# EAGLE design TinyConsole (EAGLE 9.6.2)
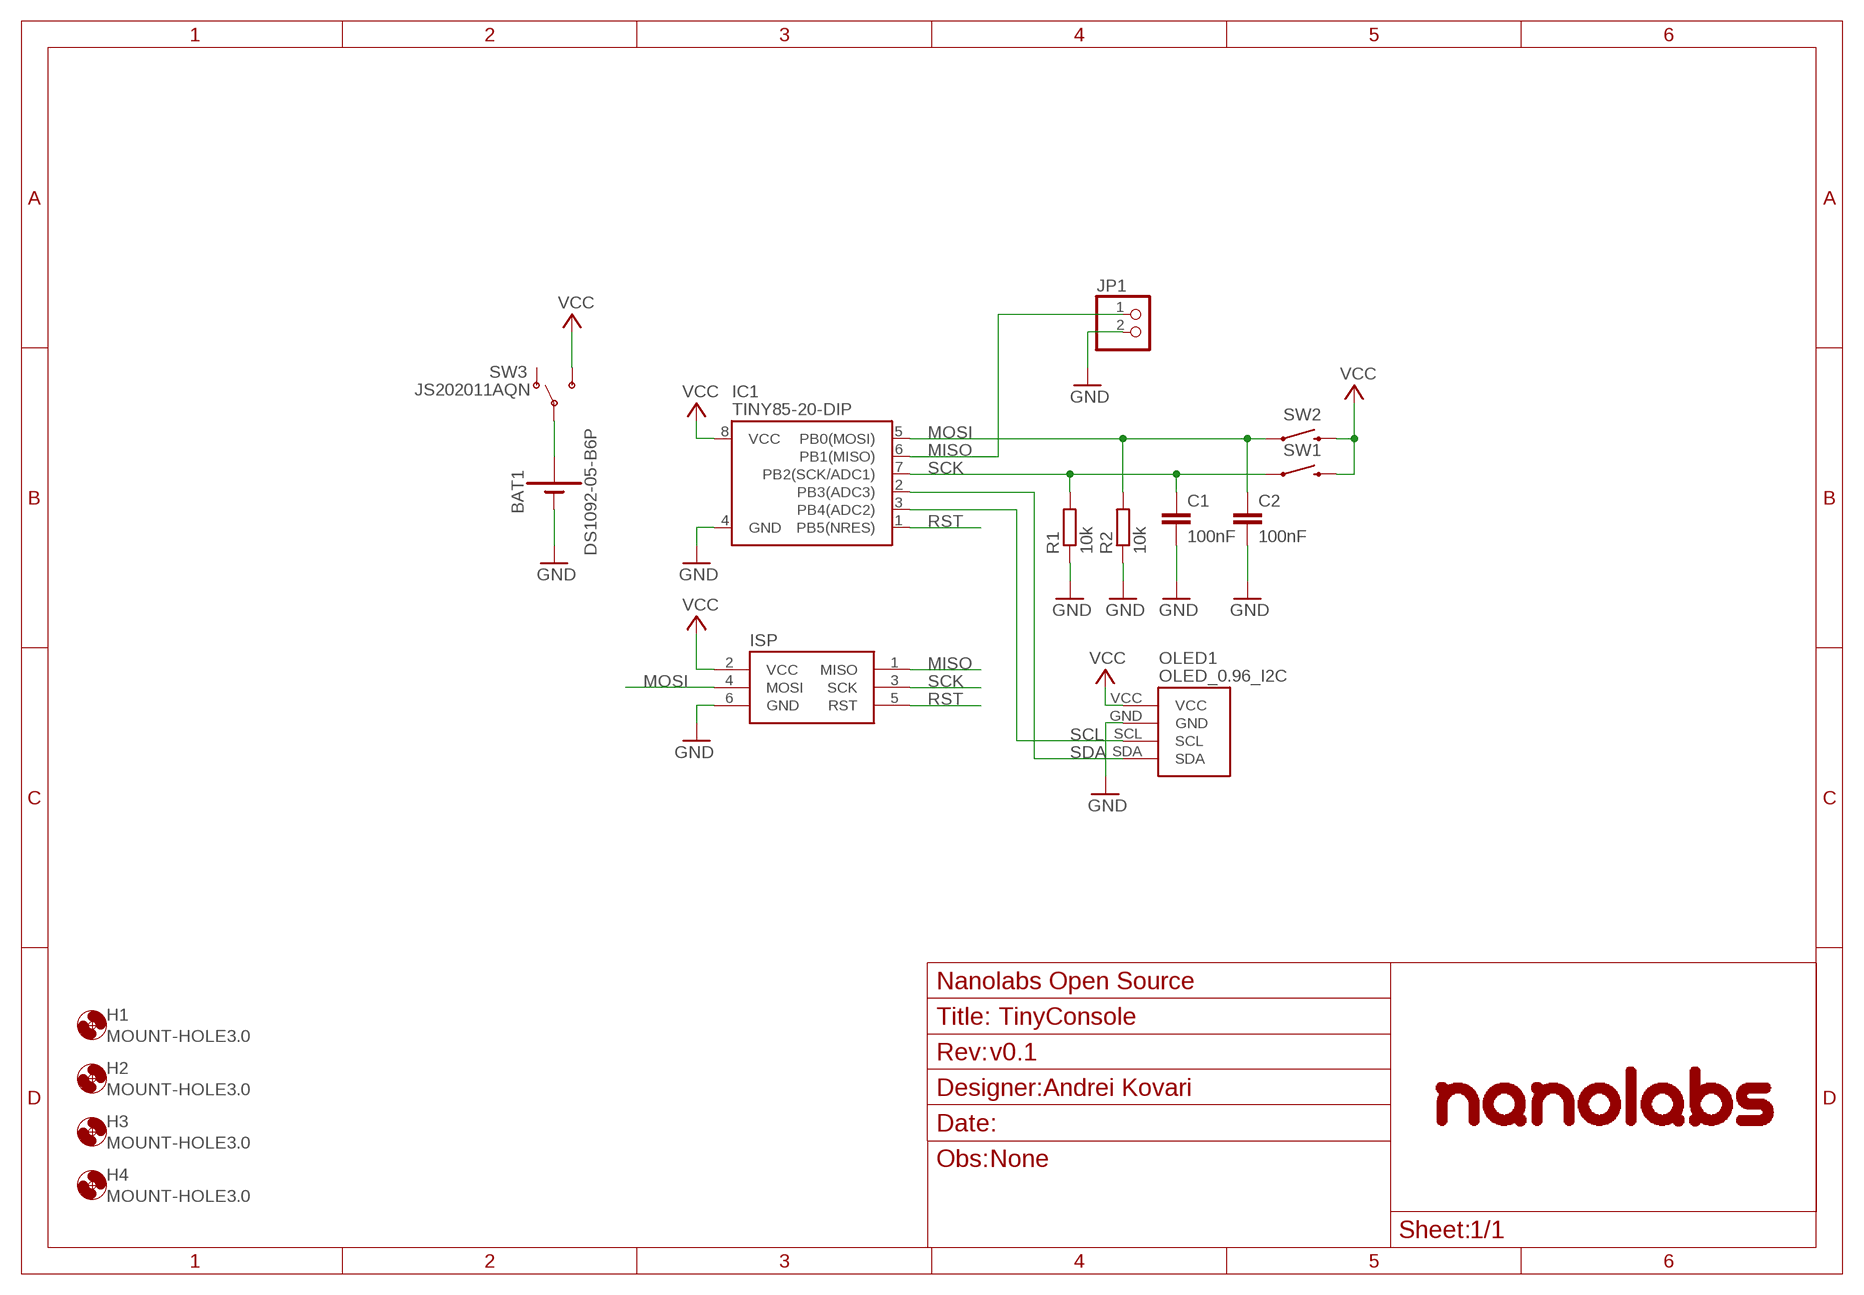
[diagram p0: schematic, sheet 1]

## Parts
BAT1  DS1092-05-B6P  [DS1092-05-B6P]
C1  100nF  C-EU050-025X075  [C050-025X075]
C2  100nF  C-EU050-025X075  [C050-025X075]
FRAME1  Nanolabs Open Source  FRAME_A4_NANOLABS  [DOCU]
H1  MOUNT-HOLE3.0  [3,0]
H2  MOUNT-HOLE3.0  [3,0]
H3  MOUNT-HOLE3.0  [3,0]
H4  MOUNT-HOLE3.0  [3,0]
IC1  TINY85-20-DIP  ATTINY45TINY85-20-DIP  [DIP08]
ISP  AVRISP-6  [AVRISP]
JP1  PINHD-1X2  [1X02]
OLED1  OLED_0.96_I2C  [OLED_0.96_I2C]
R1  10k  R-EU_0207/7  [0207/7]
R2  10k  R-EU_0207/7  [0207/7]
SW1  SWITCH-MOMENTARY-212MM  [TACTILE-PTH-12MM]
SW2  SWITCH-MOMENTARY-212MM  [TACTILE-PTH-12MM]
SW3  JS202011AQN  [JS202011AQN]

## Nets
GND: BAT1.- C1.2 C2.2 IC1.4(GND) ISP.6(GND) JP1.2 OLED1.GND R1.1 R2.1
MISO: IC1.6(PB1(MISO)) ISP.1(MISO) JP1.1
MOSI: C2.1 IC1.5(PB0(MOSI)) ISP.4(MOSI) R2.2 SW2.1
N$1: BAT1.+ SW3.2(COM) SW3.5(COM)
RST: IC1.1(PB5(NRES)) ISP.5(RST)
SCK: C1.1 IC1.7(PB2(SCK/ADC1)) ISP.3(SCK) R1.2 SW1.1
SCL: IC1.3(PB4(ADC2)) OLED1.SCL
SDA: IC1.2(PB3(ADC3)) OLED1.SDA
VCC: IC1.8(VCC) ISP.2(VCC) OLED1.VCC SW1.3 SW2.3 SW3.3(NO) SW3.6(NO)
Unconnected: SW3.1(NC) SW3.4(NC)

## Library data of the parts
BAT1 = DS1092-05-B6P:DS1092-05-B6P
C1 C2 = rcl:C-EU: CAPACITOR, European symbol; SPICEPREFIX: C
FRAME1 = AndreiKovari Frames:FRAME_A4_NANOLABS; DNAME: Andrei Kovari; OBS: None; REVNUM: v0.1
H1-H4 = holes:MOUNT-HOLE: MOUNTING HOLE with drill center marker
IC1 = SparkFun-DigitalIC:ATTINY45: Atmel 8-pin 2/4/8kB flash uC; PROD_ID: IC-09445
ISP = adafruit:AVRISP: AVR ISP HEADER Standard 6 pin header for AVR programming
JP1 = pinhead:PINHD-1X2: PIN HEADER
OLED1 = tft_1.8_1.44_oled_0.96:OLED_0.96_I2C
R1 R2 = rcl:R-EU_: RESISTOR, European symbol; SPICEPREFIX: R
SW1 SW2 = SparkFun-Electromechanical:SWITCH-MOMENTARY-2: Various NO switches- pushbuttons, reed, etc; PROD_ID: SWCH-09185
SW3 = JS202011AQN:JS202011AQN

## Board
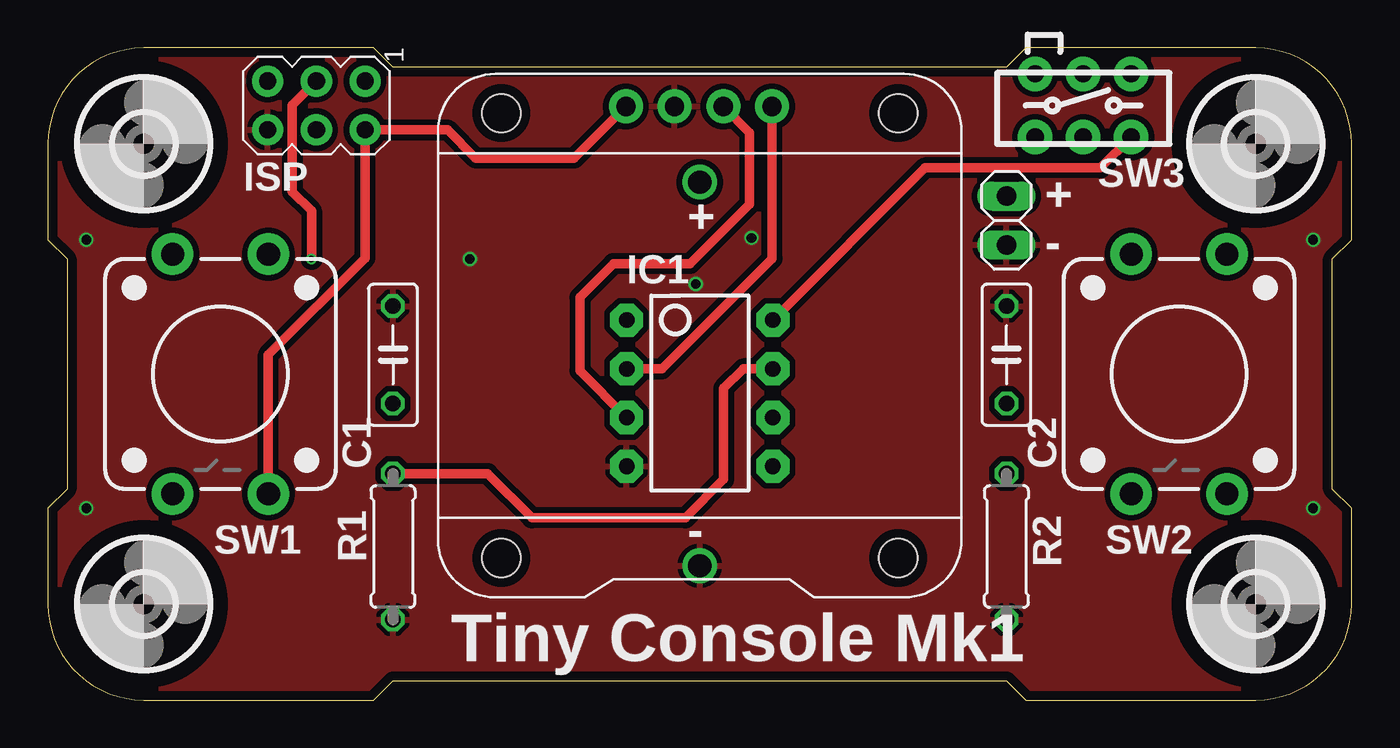
[diagram p1: board, top side]
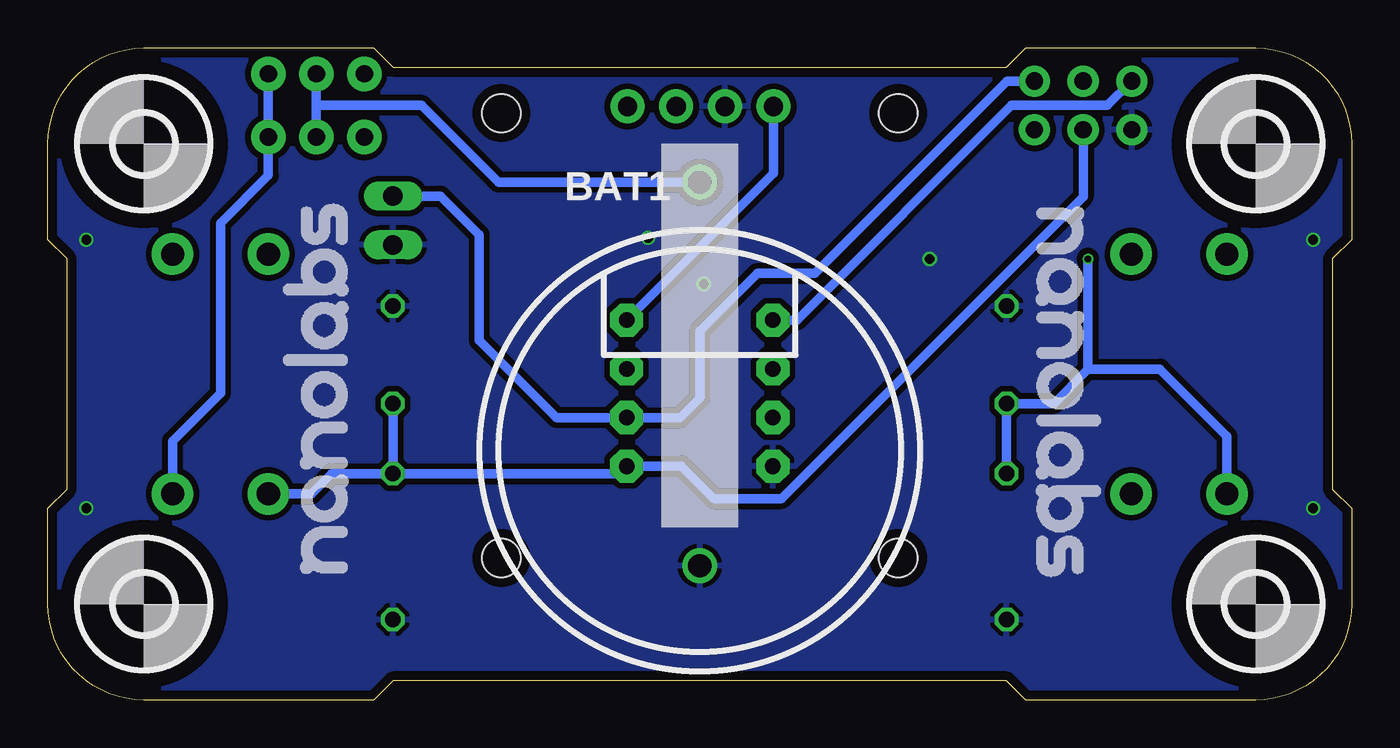
[diagram p2: board, bottom side, seen from below]

Size 68 x 34 mm. Coordinates in mm from the lower left corner, seen from the top.
Outline: 17,34 5,34 arc90 0,29 0,24 1,23 1,11 0,10 0,5 arc90 5,0 17,0 18,1 50,1 51,0 63,0 arc90 68,5 68,10 67,11 67,23 68,24 68,29 arc90 63,34 51,34 50,33 18,33 17,34
Copper layers (1*16): Top 0.035mm / dielectric 1.5mm / Bottom 0.035mm
Design rules "Nanolabs_2layer_Standard *": minimum track width 0.15mm, minimum drill 0.35mm, track to track 0.15mm, track to pad 0.15mm, pad to pad 0.15mm, via to via 0.15mm, smd to smd 0mil, copper to edge 0.5mm, drill to drill 0.15mm, minimum pad ring 0.1mm, minimum via ring 0.1mm, stop-mask expansion 0.1mm, vias tented up to drill 0.5mm, thermal gap 0.25mm

### Footprints (pad centres in the part's own frame; a part is rotated, then mirrored left to right if it is on the bottom)
DS1092-05-B6P = drill 1.2: + 14,0; - -6,0
C050-025X075 = drill 0.813 octagon: 1 -2.54,0; 2 2.54,0
3,0 = hole 3: 0,0
DIP08 = drill 0.813 pad 1.727 octagon: 1 -3.81,-3.81; 2 -1.27,-3.81; 3 1.27,-3.81; 4 3.81,-3.81; 5 3.81,3.81; 6 1.27,3.81; 7 -1.27,3.81; 8 -3.81,3.81
AVRISP = drill 0.9 pad 1.626: 1 -1.27,2.54; 2 1.27,2.54; 3 -1.27,0; 4 1.27,0; 5 -1.27,-2.54; 6 1.27,-2.54
1X02 = drill 1.016 long: 1 -1.27,0; 2 1.27,0
OLED_0.96_I2C = drill 1 pad 1.778: GND -1.31,11.95; SCL 1.23,11.95; SDA 3.77,11.95; VCC -3.85,11.95 | hole 2: -10.35,-11.6; 10.35,-11.6; 10.35,11.6; -10.35,11.6
0207/7 = drill 0.813 octagon: 1 -3.81,0; 2 3.81,0
TACTILE-PTH-12MM = drill 1.2 pad 2.159: 1 6.25,-2.5; 2 -6.25,-2.5; 3 6.25,2.5; 4 -6.25,2.5
JS202011AQN = drill 0.9 pad 1.8: 1 -2.5,-1.65; 2 0,-1.65; 3 2.5,-1.65; 4 -2.5,1.65; 5 0,1.65; 6 2.5,1.65

### Placement (x,y rotation side)
BAT1  34,13 90 bottom
C1  18,18 90 top
C2  50,18 90 top
FRAME1  0,-2 0 top
H1  5,29 0 top
H2  5,5 0 top
H3  63,5 0 top
H4  63,29 0 top
IC1  34,16 270 top
ISP  14,31 270 top
JP1  50,25 270 top
OLED1  34,19 0 top
R1  18,8 90 top
R2  50,8 90 top
SW1  9,17 270 top
SW2  59,17 270 top
SW3  54,31 0 top
U$1  [NANOLOGO1]  51.9,6.4 90 bottom
U$2  [NANOLOGO1]  16.9,25.9 270 bottom

### Tracks (layer width: path | path; a pad name or v marks a point on that pad's centre or on a via)
GND  (via drill 0.5)
  other vias: 22,23 66,24 66,10 2,10 2,24 33.8,21.7 36.7,24.1
  pour Top (isolate 0.3): 0,0 68,0 68,34 0,34
  pour Bottom (isolate 0.3): 0,0 68,0 68,34 0,34
MISO
  Bottom 0.5: JP1.1 47.52,26.27 45.5,24.25 45.5,18.75 41.48,14.73 IC1.6 35.02,14.73 34,15.75 34,19.25 31,22.25 28,22.25 17.98,32.27 ISP.1
MOSI
  Bottom 0.5: C2.1 R2.2 | SW2.1 54.25,10.75 53.19,11.81 R2.2 | R2.2 38.19,11.81 IC1.5 34.94,12.19 33.25,10.5 29.75,10.5 14,26.25 ISP.4
N$1
  Bottom 0.5: SW3.5 54,31 | 54,31 SW3.2 | BAT1.+ 44.5,27 48.5,31 54,31
RST
  Bottom 0.5: ISP.5 12.73,31 17.75,31 28.94,19.81 IC1.1
SCK  (via drill 0.35)
  Top 0.5: ISP.3 12.75,31.02 12.75,26.5 13.75,25.5 v13.75,23 | IC1.7 36.27,17.27 35.25,16.25 35.25,11.5 33.25,9.5 25.25,9.5 22.94,11.81 R1.2
  Bottom 0.5: R1.2 C1.1 15.54,15.46 13.75,17.25 | v13.75,23 13.75,17.25 | 13.75,17.25 10,17.25 6.5,13.75 SW1.1
SCL
  Top 0.5: OLED1.SCL 36.6,29.58 36.6,25.85 33.5,22.75 29.5,22.75 27.75,21 27.75,17.17 IC1.3
SDA
  Top 0.5: OLED1.SDA 37.77,23.02 32.02,17.27 IC1.2
VCC
  Top 0.5: SW3.3 54.9,27.75 45.75,27.75 IC1.8 | SW1.3 11.5,18 16.54,23.04 ISP.2 20.84,29.73 22.32,28.25 27.45,28.25 OLED1.VCC
  Bottom 0.5: SW3.6 SW3.3 56.5,27.35 59,24.85 59,16 61.5,13.5 SW2.3 | OLED1.VCC 30.15,27.47 IC1.8

### Text on the board
tPlace: + | + | - | - | Tiny Console Mk1